# EAGLE design sensor_eeprom_v3.0 (EAGLE 9.6.2)
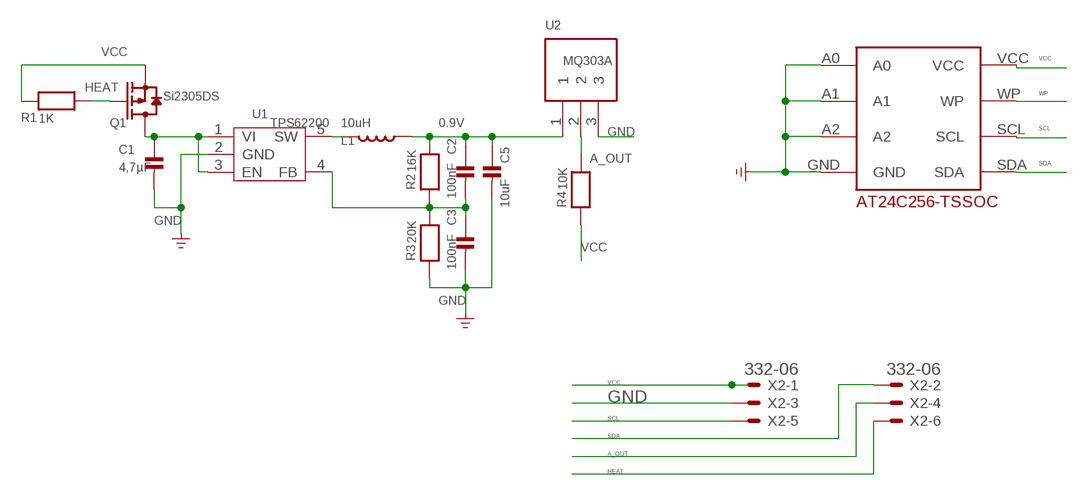
[diagram p0: schematic, sheet 1]

## Parts
C1  4,7µF  CAP_CERAMIC0805  [0805]
C2  100nF  CAP_CERAMIC0805  [0805]
C3  100nF  CAP_CERAMIC0805  [0805]
C5  10uF  CAP_CERAMIC0805  [0805]
L1  10uH  L'PIO73'  [PIO73]
Q1  Si2305DS  MOSFET-P'SI2323CDS/SI2305DS<BR>'  [SOT23]
R1  1K  RESISTOR0805  [0805]
R2  16K  RESISTOR0805  [0805]
R3  20K  RESISTOR0805  [0805]
R4  10K  RESISTOR0805  [0805]
U1  TPS62200  TPS62200DBV  [SOT23-5]
U2  MQ303A  [MQ303A]
U$1  DECADE-AT24C256-10TI-2.7  [DECADE-AT24CXX]
X2  332-06  [332-06]

## Nets
0.9V: C2.1 C5.1 L1.2 R2.2 U2.1
A_OUT: R4.2 U2.2 X2.4
GND: C1.2 C3.2 C5.2 R3.1 U1.2(GND) U2.3 U$1.A0 U$1.A1 U$1.A2 U$1.GND X2.3
HEAT: Q1.1(G) R1.2 X2.6
N$1: C1.1 Q1.3(D) U1.1(VI) U1.3(EN)
N$2: L1.1 U1.5(SW)
N$3: C2.2 C3.1 R2.1 R3.2 U1.4(FB)
SCL: U$1.SCL X2.5
SDA: U$1.SDA X2.2
VCC: Q1.2(S) R1.1 R4.1 U$1.VCC X2.1
WP: U$1.WP

## Library data of the parts
C1-C3 C5 = microbuilder:CAP_CERAMIC: Ceramic Capacitors 0402 - 0402 Surface Mount Capacitors 16pF 50V 5% [Digikey: 445-4899-2-ND] 18pF 50V 5% [Digikey: 490-1281-2-ND] 22pF 50V 5% [Digikey: 490-1283-2-ND] 68pF 50V 5% [Digikey: 490-1289-2-ND] 0.1uF 10V 10% [Digikey: 490-1318-2-ND] 1.0uF 6.3V 10% [Digikey: 490-1320-2-ND] 0603 - 0603 Surface Mount Capacitors 16 pF 50V 5% [Digikey: 445-5051-2-ND] 22 pF 50V [Digikey: PCC220ACVTR-ND] 33 pF 50V 5% [Digikey: 490-1415-1-ND] 56pF 50V 5% [Digikey: 490-1421-1-ND] 220pF 50V 5% [Digikey: 445-1285-1-ND] 680 pF 50V 2200 pF 50V 5% C0G [Digikey: 445-1297-1-ND] 5600 pF 100V 5% X7R [Digikey: 478-3711-1-ND] 0.1 µF 25V 10% [Digikey: PCC2277TR-ND] 0.22 µF 16V 10% X7R [Digikey: 445-1318-1-ND] 1.0 µF 25V 10% [Digikey: 445-5146-2-ND] 0603 - RF Specific 3pF 250V +/-0.1pF RF [Digikey: 712-1347-1-ND] 18 pF 250V 5% [Digikey: 478-3505-1-ND or 712-1322-1-ND] 56 pF 250V 5% C0G RF [Digikey: 490-4867-1-ND] 68 pF 250V RF [Digikey: 490-4868-1-ND] 0805 - 0805 Surface Mount Capacitors 220 pF 250V 2% RF Ceramic Capacitor [Digikey: 712-1398-1-ND] 1000 pF 50V 2% NP0 Ceramic Capacitor [Digikey: 478-3760-1-ND] 0.1 µF 25V 10% Ceramic Capacitor [Digikey: PCC1828TR-ND] 1.0 µF 16V 10% Ceramic Capacitor[Digikey: 490-1691-2-ND] 10.0 µF 10V 10% Ceramic Capacitor[Digikey: 709-1228-1-ND] 10.0 uF 16V 10% Ceramic Capacitor [Digikey: 478-5165-2-ND] 47 uF 6.3V 20% Ceramic Capacitor [Digikey: 587-1779-1-ND or 399-5506-1-ND] 1206 - 1206 Surface Mount Capacitors 47uF 10V 20% Ceramic Capacitor [Digikey: 490-5528-1-ND or 399-5508-1-ND or 445-6010-1-ND] 100uF 6.3V -20%, +80% Y5V Ceramic Capacitor (Digikey: 490-4512-1-ND, Mouser: 81-GRM31CF50J107ZE1L)
L1 = Discrete:L*
Q1 = Discrete:MOSFET-P
R1-R4 = microbuilder:RESISTOR: Resistors 0402 - 0402 Surface Mount Package 22 Ohm 1% 1/16W [Digikey: 311-22.0LRTR-ND] 33 Ohm 5% 1/16W 1.0K 5% 1/16W 1.5K 5% 1/16W 2.0K 1% 1/16W 10.0K 1% 1/16W [Digikey: 311-10.0KLRTR-ND] 10.0K 5% 1/16W [Digikey: RMCF0402JT10K0TR-ND] 12.1K 1% 1/16W [Digikey: 311-22.0LRTR-ND] 100.0K 5% 1/16W 0603 - 0603 Surface Mount Package 0 Ohm 1/10 Watt 1% Resistor 15 Ohm 1/10 Watt 1% Resistor 33 Ohm 1/10 Watt 1% Resistor 49.9 Ohm 1/10 Watt 1% Resistor 100 Ohm 1/10 Watt 1% Resistor 150 Ohm 1/10 Watt 1% Resistor 240 Ohm 1/10 Watt 1% Resistor 390 Ohm 1/10 Watt 1% Resistor 560 Ohm 1/10 Watt 1% Resistor 680 Ohm 1/10 Watt 1% Resistor 750 Ohm 1/10 Watt 1% Resistor 1.0K Ohm 1/10 Watt 1% Resistor 1.5K Ohm 1/10 Watt 1% Resistor 2.0K Ohm 1/10 Watt 1% Resistor 2.2K Ohm 1/10 Watt 1% Resistor 3.3K Ohm 1/10 Watt 1% Resistor 4.7K Ohm 1/10 Watt 1% Resistor 10.0K Ohm 1/10 Watt 1% Resistor 12.0K Ohm 1/10 Watt 1% Resistor 12.1K Ohm 1/10 Watt 1% Resistor 20.0K Ohm 1/10 Watt 1% Resistor 33.0K Ohm 1/10 Watt 1% Resistor 100.0K Ohm 1/10 Watt 1% Resistor 0805 - 0805 Surface Mount Package 0 Ohm 1/8 Watt 1% Resistor 33 Ohm 1/8 Watt 1% Resistor 100 Ohm 1/8 Watt 1% Resistor 150 Ohm 1/8 Watt 1% Resistor 200 Ohm 1/8 Watt 1% Resistor 240 Ohm 1/8 Watt 1% Resistor 330 Ohm 1/8 Watt 1% Resistor 390 Ohm 1/8 Watt 1% Resistor 470 Ohm 1/8 Watt 1% Resistor 1.0K Ohm 1/8 Watt 1% Resistor 1.5K Ohm 1/8 Watt 1% Resistor 2.0K Ohm 1/8 Watt 1% Resistor 4.7K Ohm 1/8 Watt 1% Resistor 5.1K Ohm 1/8 Watt 1% Resistor 5.6K Ohm 1/8 Watt 1% Resistor 10.0K Ohm 1/8 Watt 1% Resistor 22.0K Ohm 1/8 Watt 1% Resistor 33.0K Ohm 1/8 Watt 1% Resistor 100K Ohm 1/8 Watt 1% Resistor 1206 - 1206 Surface Mount Package 2012 - 2010 Surface Mount Package 0.11 Ohm 1/2 Watt 1% Resistor - Digikey: RHM.11UCT-ND
U1 = IC:TPS62200: High-Efficiency,SOT23 STEP-DOWN,DC-DC Converter
U2 = MQ303A:MQ303A
U$1 = DECADE-libraries20151104:DECADE-AT24C256-10TI-2.7
X2 = con-garry:332-06: 6 Pin - 2mm Dual Row Source: www.mpe-connector.de / garry_shortform_2012.pdf

## Board
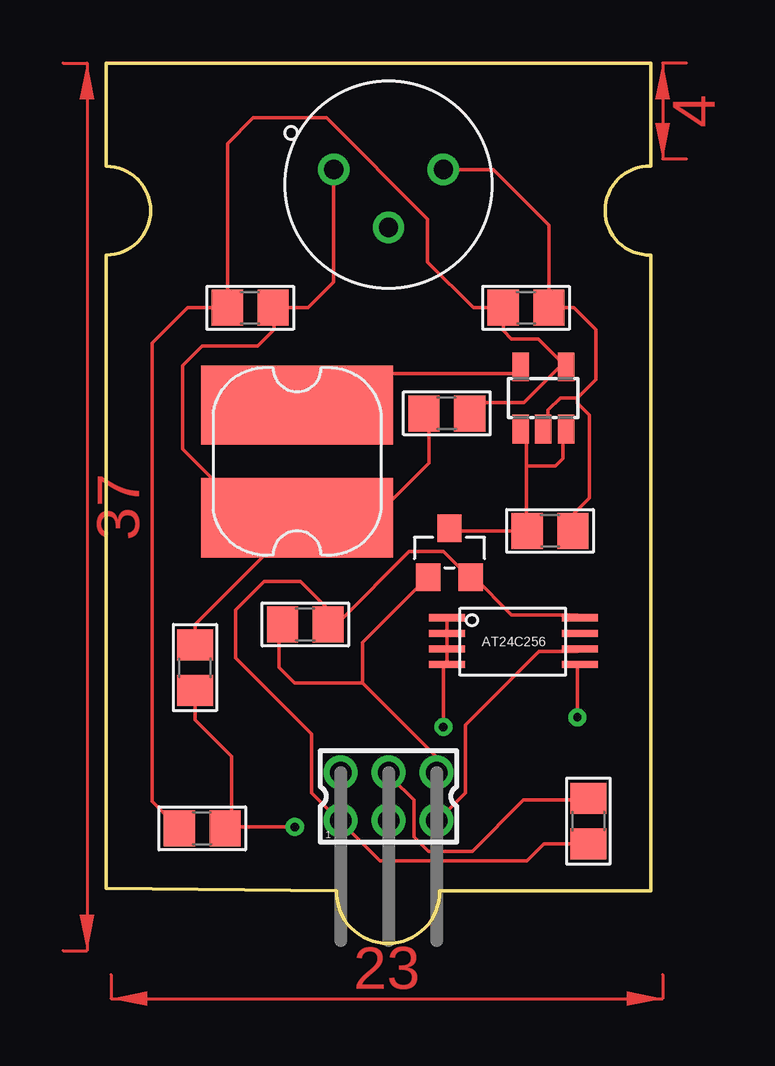
[diagram p1: board, top side]
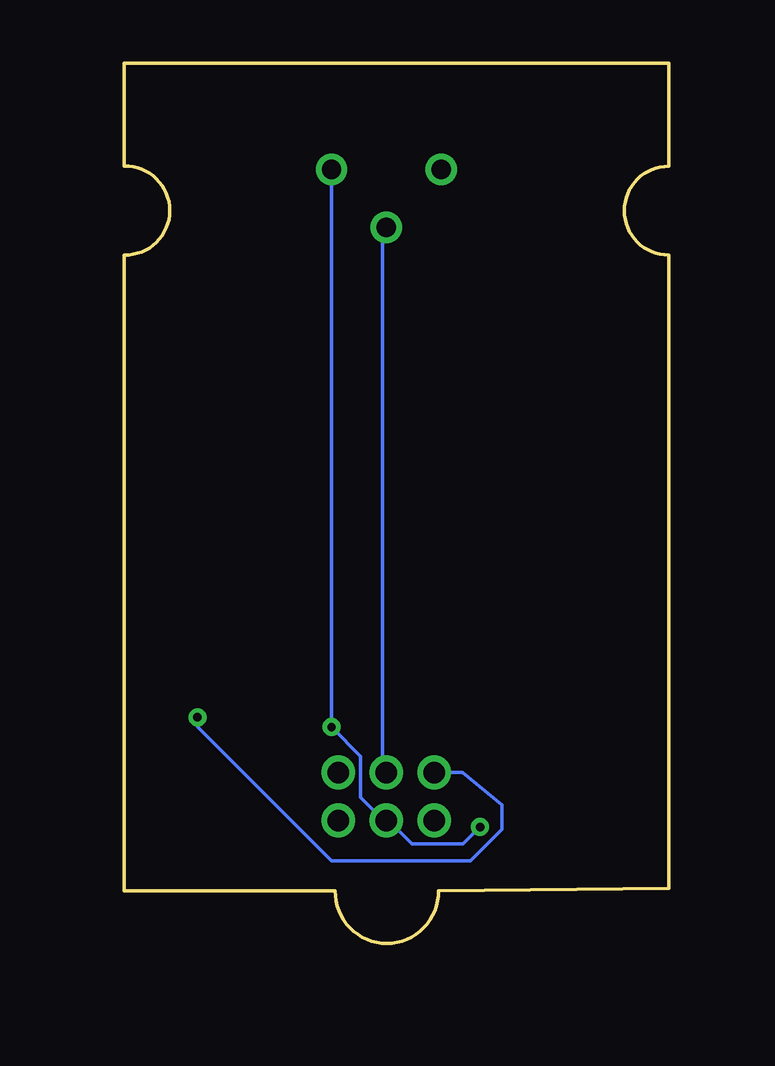
[diagram p2: board, bottom side, seen from below]

Size 22.7 x 36.7 mm. Coordinates in mm from the lower left corner, seen from the top.
Outline: 0,36.7 0,32.4 arc-180 0,28.7 0,2.3 9.6,2.2 arc183 13.9,2.2 22.7,2.2 22.7,28.7 arc-183 22.7,32.4 22.7,36.7 0,36.7
Copper layers (1*16): Top 0.035mm / dielectric 1.5mm / Bottom 0.035mm
Design rules "default": minimum track width 6mil, minimum drill 0.35mm, track to track 6mil, track to pad 6mil, pad to pad 6mil, via to via 6mil, smd to smd 6mil, copper to edge 40mil, drill to drill 6mil, minimum pad ring 10mil, minimum via ring 8mil, stop-mask expansion 4mil, vias tented up to drill 0mil, thermal gap 10mil

### Footprints (pad centres in the part's own frame; a part is rotated, then mirrored left to right if it is on the bottom)
0805 = smd 1.3 x 1.5: 1 -0.95,0; 2 0.95,0
PIO73 = smd 8 x 3.3: 1 0,2.35; 2 0,-2.35
SOT23 = smd 1.016 x 1.143: 1 -0.889,-1.016; 2 0.889,-1.016; 3 0,1.016
SOT23-5 = smd 0.69 x 1.2: 1 -0.95,-1.3; 2 0,-1.3; 3 0.95,-1.3; 4 0.95,1.3; 5 -0.95,1.3
MQ303A = drill 0.8: 1 -2.286,0.635; 2 0,-1.778; 3 2.286,0.635
DECADE-AT24CXX = smd 1.5 x 0.3: A0 -2.75,1; A1 -2.75,0.35; A2 -2.75,-0.3; GND -2.75,-0.95; SCL 2.8,-0.3; SDA 2.8,-0.95; VCC 2.8,1; WP 2.8,0.35
332-06 = drill 0.9 pad 1.27: 1 -2,-1; 2 -2,1; 3 0,-1; 4 0,1; 5 2,-1; 6 2,1

### Placement (x,y rotation side)
C1  18.5,17.2 0 top
C2  6,26.5 180 top
C3  17.5,26.5 0 top
C5  3.7,11.5 270 top
L1  7.96,20.1 0 top
Q1  14.31,16.29 0 top
R1  8.3,13.3 180 top
R2  14.2,22.1 180 top
R3  4,4.8 180 top
R4  20.1,5.1 90 top
U1  18.22,22.74 0 top
U2  11.77,31.63 0 top
U$1  16.95,12.58 0 top
X2  11.77,6.13 0 top

### Tracks (layer width: path | path; a pad name or v marks a point on that pad's centre or on a via)
0.9V
  Top 0.152: U2.1 9.48,27.57 8.42,26.5 7,26.5 | L1.2 7.96,17.87 11.28,17.87 13.45,20.03 13.45,21.9 R2.2 | 7.35,16.95 7.96,17.56 L1.2 | 7.35,16.95 7.1,16.7 | 7.1,16.7 3.7,13.3 C5.1 | 7.1,16.7 3.19,20.61 3.19,24.1 3.99,24.9 6.3,24.9 7,25.6 7,26.5 | 7.35,16.95 L1.2 | 7,26.5 C2.1
A_OUT
  Top 0.152: X2.4 11.92,6.89 12.84,5.98 12.84,4.45 13.44,3.85 15.26,3.85 17.39,5.98 20.03,5.98 R4.2
  Bottom 0.152: U2.2 11.92,29.6 11.92,7.2 X2.4
GND  (via drill 0.35)
  Top 0.152: v7.86,4.86 5.01,4.86 R3.1 5.23,5.08 5.23,7.79 3.7,9.32 C5.2 | 19.64,22.74 18.93,22.74 18.42,22.23 18.42,21.62 U1.2 | 19.64,22.74 19.64,22.75 20.41,23.51 20.41,25.59 19.5,26.5 C3.2 18.45,29.95 16.13,32.27 U2.3 | 19.64,22.74 19.64,22.54 20.15,22.03 20.15,18.57 19.45,17.87 C1.2 | v14.06,9.03 14.06,11.49 U$1.GND U$1.A2 U$1.A1 U$1.A0
  Bottom 0.152: v7.86,4.86 8.57,4.15 10.7,4.15 11.62,5.06 X2.3 11.88,5.13 12.84,6.08 12.84,7.81 v14.06,9.03 U2.3
HEAT
  Top 0.152: 7.21,11.51 7.86,10.87 10.69,10.87 | 7.21,11.51 7.2,11.53 | 13.14,15.12 Q1.1 10.69,12.54 10.69,10.87 | 10.69,10.87 13.75,7.81 13.75,7.2 X2.6 | 7.21,11.51 7.21,13.16 R1.2
N$1
  Top 0.152: 14.38,17.66 14.34,17.43 | 14.34,17.43 Q1.3 | 17.51,19.9 17.51,21.32 U1.1 | 17.51,19.9 18.73,19.9 19.03,20.21 19.03,21.32 U1.3 | 17.51,19.9 17.51,17.24 C1.1 14.57,17.2 14.34,17.43
N$2
  Top 0.152: U1.5 17.2,23.76 8.97,23.76 7.96,22.74 L1.1
N$3
  Top 0.152: U1.4 18.92,24.04 17.42,22.54 15.59,22.54 R2.1 | U1.4 19.03,24.06 | R3.2 1.92,5.93 1.92,25.02 3.4,26.5 C2.2 5.05,33.34 6.13,34.43 9.17,34.43 13.4,30.2 13.4,28.4 15.3,26.5 C3.1 16.55,25.55 16.9,25.2 18.01,25.2 U1.4
SCL
  Top 0.152: U$1.SCL 19.64,12.17 18.03,12.17 14.97,9.11 14.97,6.28 14.06,5.37 X2.5
SDA  (via drill 0.35)
  Top 0.152: v19.64,9.43 19.64,11.56 U$1.SDA
  Bottom 0.152: v19.64,9.43 19.64,9.03 14.06,3.44 8.27,3.44 6.95,4.75 6.95,5.77 8.59,7.13 X2.2
VCC
  Top 0.152: 9.75,13.45 12.63,16.34 14.06,16.34 14.97,15.43 Q1.2 15.32,15.27 16.9,13.7 19.64,13.7 U$1.VCC | 9.75,13.45 9.59,13.3 R1.1 | 9.75,13.45 8.11,15.09 6.59,15.09 5.4,13.9 5.4,11.9 8.57,8.73 8.57,6.28 9.48,5.37 X2.1 9.79,5.06 11.41,3.44 17.54,3.44 18.25,4.15 R4.1
(copper drawn outside any net)
  shapes: Top area x3